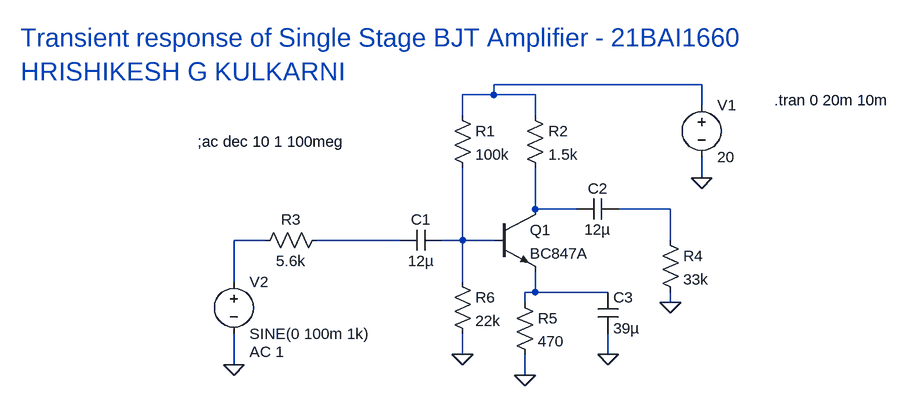
[diagram p0: schematic BJT_EXP08.asc]
BJT_EXP08.asc, the LTspice schematic file:
Version 4
SHEET 1 880 680
WIRE -1024 80 -1344 80
WIRE -1344 96 -1344 80
WIRE -1344 96 -1392 96
WIRE -1280 96 -1344 96
WIRE -1024 112 -1024 80
WIRE -1392 128 -1392 96
WIRE -1280 128 -1280 96
WIRE -1024 224 -1024 192
WIRE -1280 272 -1280 208
WIRE -1216 272 -1280 272
WIRE -1072 272 -1152 272
WIRE -1696 320 -1744 320
WIRE -1488 320 -1616 320
WIRE -1392 320 -1392 208
WIRE -1392 320 -1424 320
WIRE -1344 320 -1392 320
WIRE -1072 320 -1072 272
WIRE -1744 384 -1744 320
WIRE -1392 384 -1392 320
WIRE -1280 400 -1280 368
WIRE -1280 400 -1296 400
WIRE -1168 400 -1280 400
WIRE -1296 416 -1296 400
WIRE -1072 416 -1072 400
WIRE -1392 496 -1392 464
WIRE -1168 496 -1168 464
WIRE -1744 512 -1744 464
WIRE -1296 528 -1296 496
FLAG -1024 224 0
FLAG -1072 416 0
FLAG -1168 496 0
FLAG -1296 528 0
FLAG -1392 496 0
FLAG -1744 512 0
SYMBOL res -1408 112 R0
SYMATTR InstName R1
SYMATTR Value 100k
SYMBOL res -1296 112 R0
SYMATTR InstName R2
SYMATTR Value 1.5k
SYMBOL voltage -1024 96 R0
WINDOW 123 0 0 Left 0
WINDOW 39 0 0 Left 0
SYMATTR InstName V1
SYMATTR Value 20
SYMBOL cap -1424 304 R90
WINDOW 0 0 32 VBottom 2
WINDOW 3 32 32 VTop 2
SYMATTR InstName C1
SYMATTR Value 12µ
SYMBOL res -1600 304 R90
WINDOW 0 0 56 VBottom 2
WINDOW 3 32 56 VTop 2
SYMATTR InstName R3
SYMATTR Value 5.6k
SYMBOL res -1088 304 R0
SYMATTR InstName R4
SYMATTR Value 33k
SYMBOL cap -1152 256 R90
WINDOW 0 0 32 VBottom 2
WINDOW 3 32 32 VTop 2
SYMATTR InstName C2
SYMATTR Value 12µ
SYMBOL npn -1344 272 R0
SYMATTR InstName Q1
SYMATTR Value BC847A
SYMBOL res -1312 400 R0
SYMATTR InstName R5
SYMATTR Value 470
SYMBOL cap -1184 400 R0
SYMATTR InstName C3
SYMATTR Value 39µ
SYMBOL res -1408 368 R0
SYMATTR InstName R6
SYMATTR Value 22k
SYMBOL voltage -1744 368 R0
WINDOW 123 24 124 Left 2
WINDOW 39 0 0 Left 0
SYMATTR InstName V2
SYMATTR Value SINE(0 100m 1k)
SYMATTR Value2 AC 1
TEXT -2072 8 Left 4 ;Transient response of Single Stage BJT Amplifier - 21BAI1660\nHRISHIKESH G KULKARNI
TEXT -1800 168 Left 2 !;ac dec 10 1 100meg
TEXT -912 104 Left 2 !.tran 0 20m 10m

The netlist it stands for:
* BJT_EXP08.asc
R1 N001 N006 100k
R2 N001 N002 1.5k
V1 N001 0 20
C1 N006 N005 12µ
R3 N005 N004 5.6k
R4 N003 0 33k
C2 N003 N002 12µ
Q1 N002 N006 N007 0 BC847A
R5 N007 0 470
C3 N007 0 39µ
R6 N006 0 22k
V2 N004 0 SINE(0 100m 1k) AC 1
.model NPN NPN
.model PNP PNP
.lib standard.bjt
* Transient response of Single Stage BJT Amplifier - 21BAI1660
* HRISHIKESH G KULKARNI
;ac dec 10 1 100meg
.tran 0 20m 10m
.backanno
.end